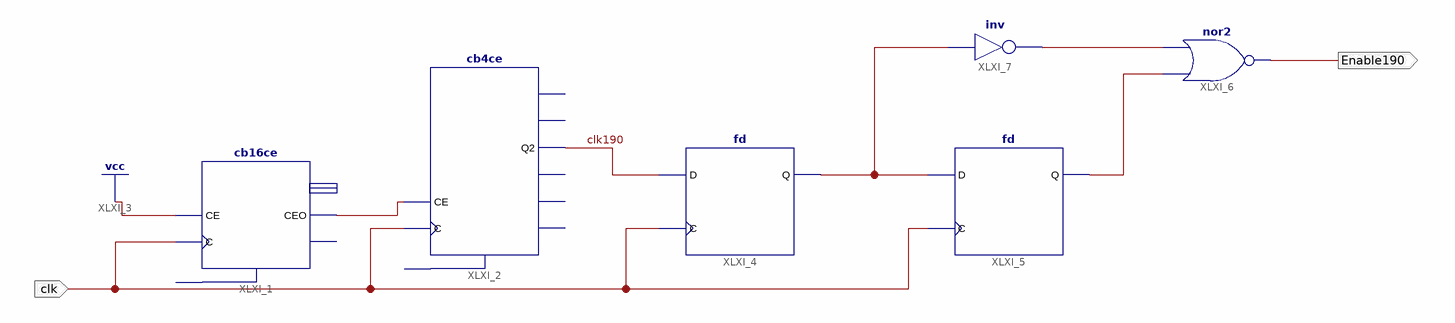
[diagram p0: schematic sheet 1]
// Xilinx ISE schematic Enable190.sch (spartan6) as structural Verilog: 6 symbols, 3 ports
module Enable190 (
  input  clk,
  output clk190,
  output Enable190
);

  wire XLXN_12, XLXN_18, XLXN_19, XLXN_20;

  cb16ce XLXI_1 (.C(clk), .CE(1'b1), .CEO(XLXN_12));  // open: CLR, Q, TC
  cb4ce XLXI_2 (.C(clk), .CE(XLXN_12), .Q2(clk190));  // open: CLR, CEO, Q0, Q1, Q3, TC
  fd XLXI_4 (.C(clk), .D(clk190), .Q(XLXN_18));
  fd XLXI_5 (.C(clk), .D(XLXN_18), .Q(XLXN_20));
  nor XLXI_6 (Enable190, XLXN_20, XLXN_19);
  not XLXI_7 (XLXN_19, XLXN_18);
endmodule
